# Altium schematic sheet Display_Sheet.SchDoc
size 420 x 297 mm; SheetNumber: 6; SheetTotal: 8
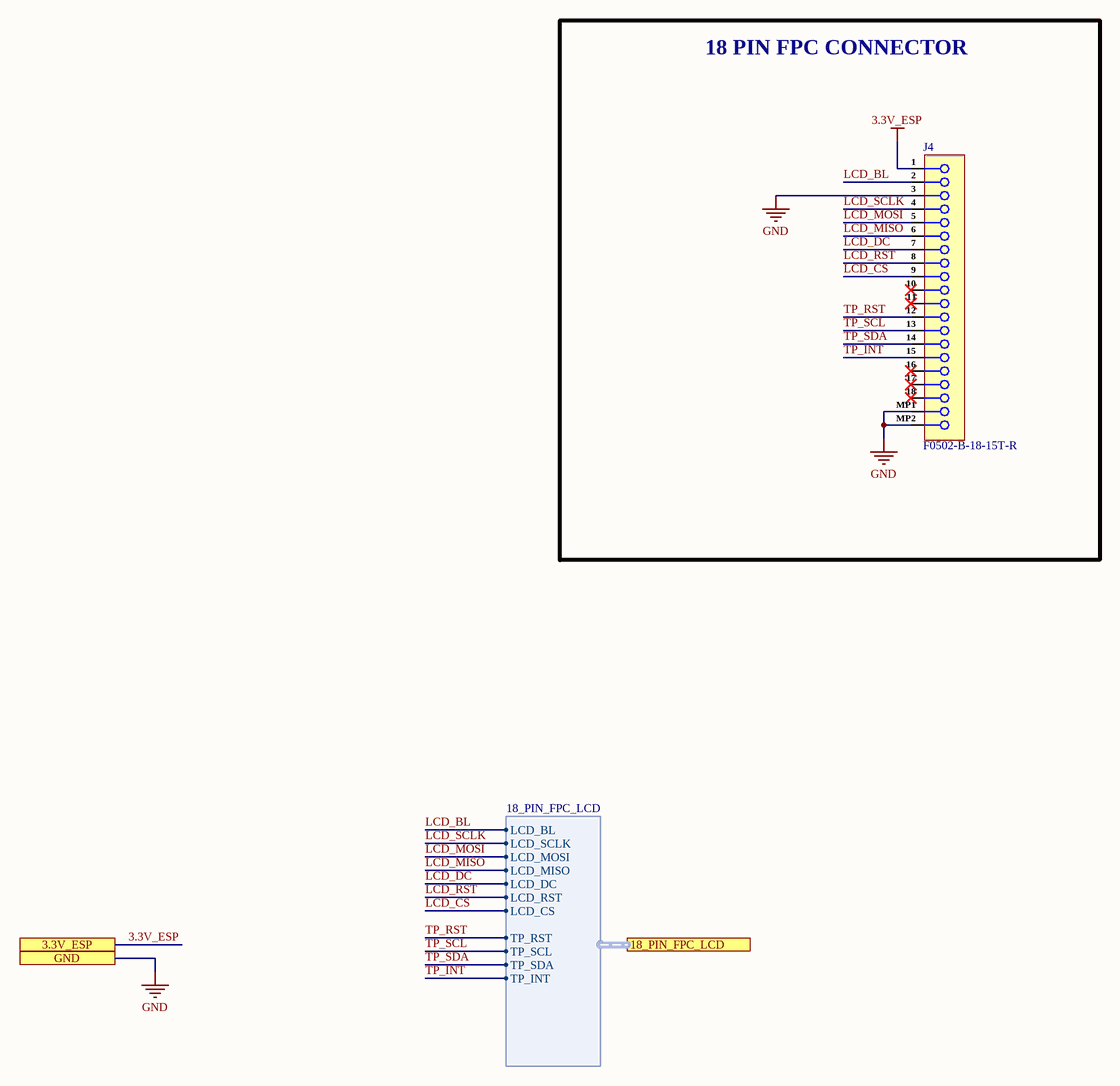
[diagram p0: Display_Sheet.SchDoc]

## Parts
J4  F0502-B-18-15T-R  [F0502-B-18-15T-R]

## Blocks framed on the sheet
18 PIN FPC CONNECTOR: J4

## Ports
3.3V_ESP (see Top_Sheet[5A], BattCharging_Sheet[2D], Controller_Sheet[3D], Ethernet_Sheet[4D], FuelGauge_Sheet[2C], Power_Sheet[1D]), 18_PIN_FPC_LCD (harness 18_PIN_FPC_LCD, see Top_Sheet[5B], Controller_Sheet[1D]), GND (see Top_Sheet[5B], BattCharging_Sheet[2D], Controller_Sheet[3D], Ethernet_Sheet[4D], FuelGauge_Sheet[2C], Power_Sheet[1D], USB_Sheet[3C])

## Harnesses
18_PIN_FPC_LCD: LCD_BL, LCD_SCLK, LCD_MOSI, LCD_MISO, LCD_DC, LCD_RST, LCD_CS, TP_RST, TP_SCL, TP_SDA, TP_INT

## Nets
3.3V_ESP: J4.1 ; port 3.3V_ESP
GND: J4.3 J4.MP1 J4.MP2 ; port GND
LCD_BL: J4.2 ; port 18_PIN_FPC_LCD.LCD_BL
LCD_CS: J4.9 ; port 18_PIN_FPC_LCD.LCD_CS
LCD_DC: J4.7 ; port 18_PIN_FPC_LCD.LCD_DC
LCD_MISO: J4.6 ; port 18_PIN_FPC_LCD.LCD_MISO
LCD_MOSI: J4.5 ; port 18_PIN_FPC_LCD.LCD_MOSI
LCD_RST: J4.8 ; port 18_PIN_FPC_LCD.LCD_RST
LCD_SCLK: J4.4 ; port 18_PIN_FPC_LCD.LCD_SCLK
TP_INT: J4.15 ; port 18_PIN_FPC_LCD.TP_INT
TP_RST: J4.12 ; port 18_PIN_FPC_LCD.TP_RST
TP_SCL: J4.13 ; port 18_PIN_FPC_LCD.TP_SCL
TP_SDA: J4.14 ; port 18_PIN_FPC_LCD.TP_SDA

Not connected (* = marked no-connect by the designer): J4 10* 11* 16* 17* 18*

## Notes on the sheet
- PROJECT
- TITLE
- DATE
- FILE NAME
- A3
- SIZE
- ENGINEER
- SHEET
- REV
- OF

## Library data of the parts
J4 = F0502-B-18-15T-R: Clamshell -25℃~+85℃ 18P Bottom Contact Surface Mount 0.5mm SMD,P=0.5mm FFC/FPC Connectors ROHS; Manufacturer: XFCN; Manufacturer Part Number: F0502-B-18-15T-R; Package: SMD,P=0.5mm; LCSC Part Number: C2889974; Item Type: FPC Connector; ComponentLink1Description: LCSC; ComponentLink1URL: https://www.lcsc.com/product-detail/FFC-FPC-Connectors_XFCN-F0502-B-18-15T-R_C2889974.html